# Altium schematic sheet CV_Mode.SchDoc
size A3; SheetNumber: 2; SheetTotal: 4
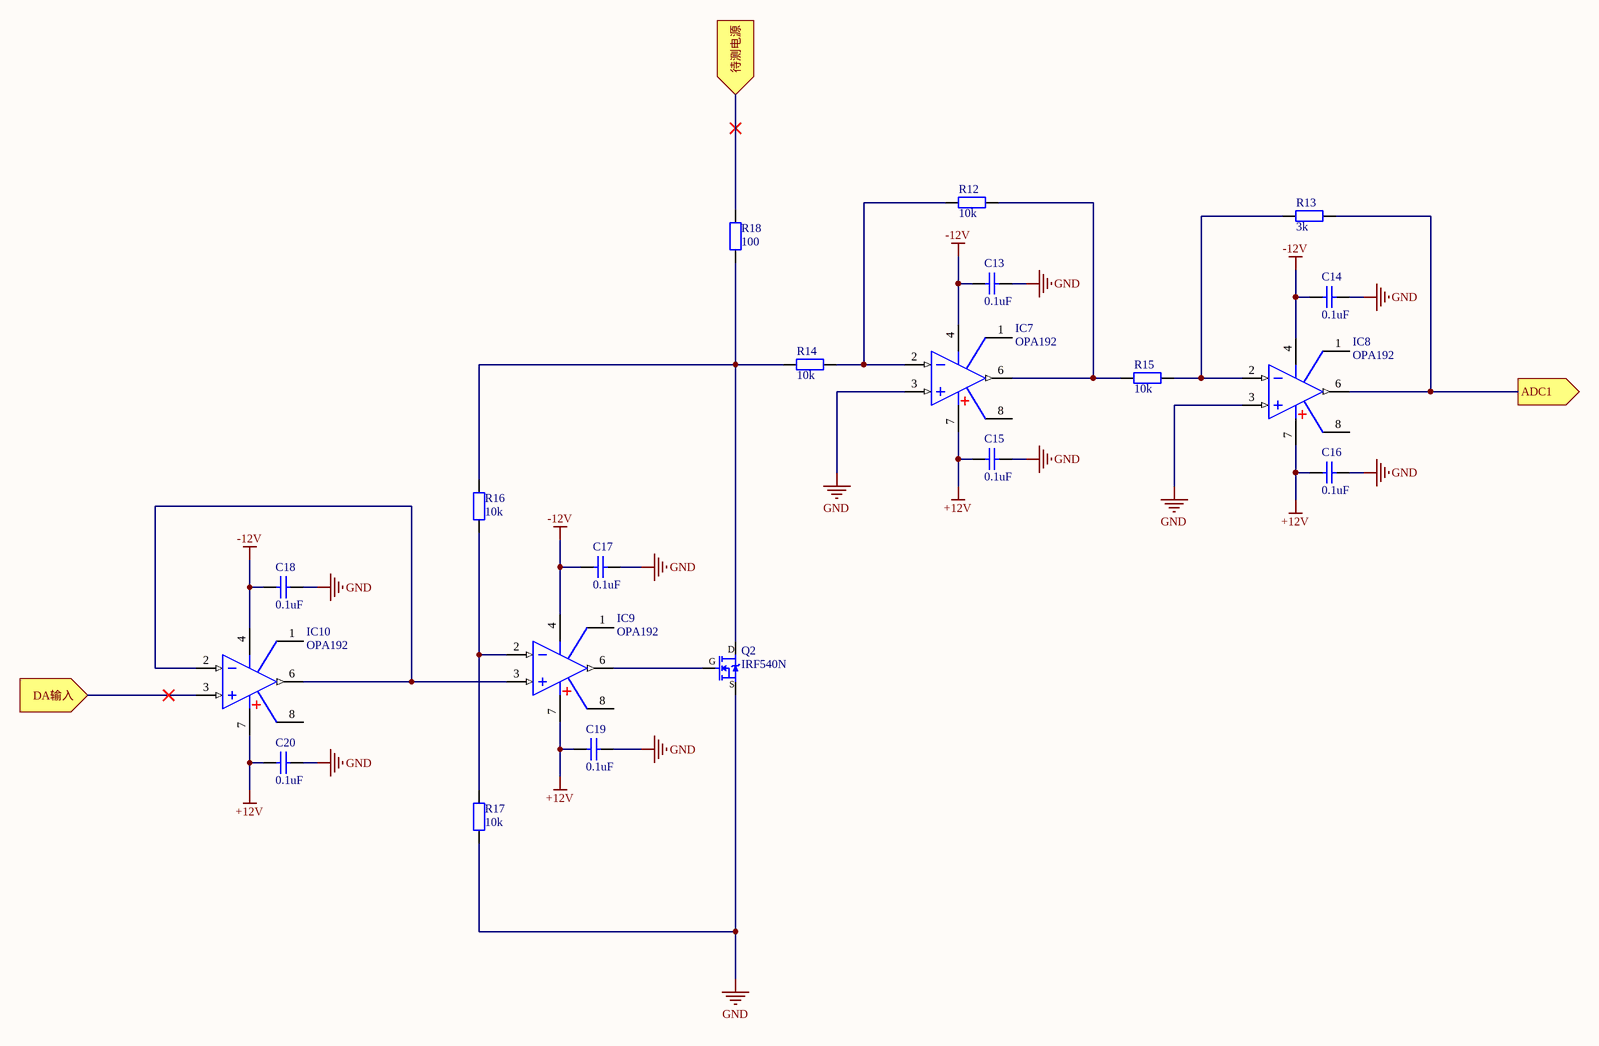
[diagram p0: CV_Mode.SchDoc]

## Parts
C13  0.1uF  [瓷片电容]
C14  0.1uF  [瓷片电容]
C15  0.1uF  [瓷片电容]
C16  0.1uF  [瓷片电容]
C17  0.1uF  [瓷片电容]
C18  0.1uF  [瓷片电容]
C19  0.1uF  [瓷片电容]
C20  0.1uF  [瓷片电容]
IC7  OPA192  [SOP8_N]
IC8  OPA192  [SOP8_N]
IC9  OPA192  [SOP8_N]
IC10  OPA192  [SOP8_N]
Q2  IRF540N  [TO263-3B]
R12  10k  [RS 1/4W]
R13  3k  [RS 1/4W]
R14  10k  [RS 1/4W]
R15  10k  [RS 1/4W]
R16  10k  [RS 1/4W]
R17  10k  [RS 1/4W]
R18  100  [RS 1/4W]

## Ports
ADC1 (out), DA输入 (in), 待测电源 (in)

## Nets
+12V: C15.1 C16.1 C19.1 C20.1 IC7.7(V+) IC8.7(V+) IC9.7(V+) IC10.7(V+)
-12V: C13.1 C14.1 C17.1 C18.1 IC7.4(V-) IC8.4(V-) IC9.4(V-) IC10.4(V-)
GND: C13.2 C14.2 C15.2 C16.2 C17.2 C18.2 C19.2 C20.2 IC7.3(IN+) IC8.3(IN+) Q2.3(D) R17.1
ADC1: IC8.6(OUT) R13.2 ; port ADC1
DA输入: IC10.3(IN+) ; port DA输入
待测电源: R18.2 ; port 待测电源
NetIC7_2: IC7.2(IN-) R12.1 R14.2
NetIC7_6: IC7.6(OUT) R12.2 R15.1
NetIC8_2: IC8.2(IN-) R13.1 R15.2
NetIC9_2: IC9.2(IN-) R16.1 R17.2
NetIC9_3: IC9.3(IN+) IC10.2(IN-) IC10.6(OUT)
NetIC9_6: IC9.6(OUT) Q2.1(G)
NetQ2_2: Q2.2(S) R14.1 R16.2 R18.1

Not connected (* = marked no-connect by the designer): IC7 1 8; IC8 1 8; IC9 1 8; IC10 1 8

## Library data of the parts
C13-C20 = Cap_DIP: 直插电容; Value: 100nF; Voltage: 63V; Published: 8-Jun-2000; Revision: July-2002: Re-released for DXP Platform.; Publisher: Altium Limited; 实物样品照片: https://item.taobao.com/item.htm?spm=a230r.1.14.32.21fd24b7VWml4d&id=37914290992&ns=1&abbucket=13#detail
IC7-IC10 = OPA192: High-Voltage, Rail-to-Rail Input/Output, 5µV, 0.2µV/˚C, Precision Operational Amplifier; BOM名称: 单路精密运放; 版权归属: 源创客; 学习资源: www.ooocke.com
Q2 = IRF540N: N沟场 100V/22A; BOM名称: 效应管; 版权归属: 源创客; 学习资源: www.ooocke.com; 描述: N沟场 100V/22A
R12-R18 = Res_DIP: 直插电阻